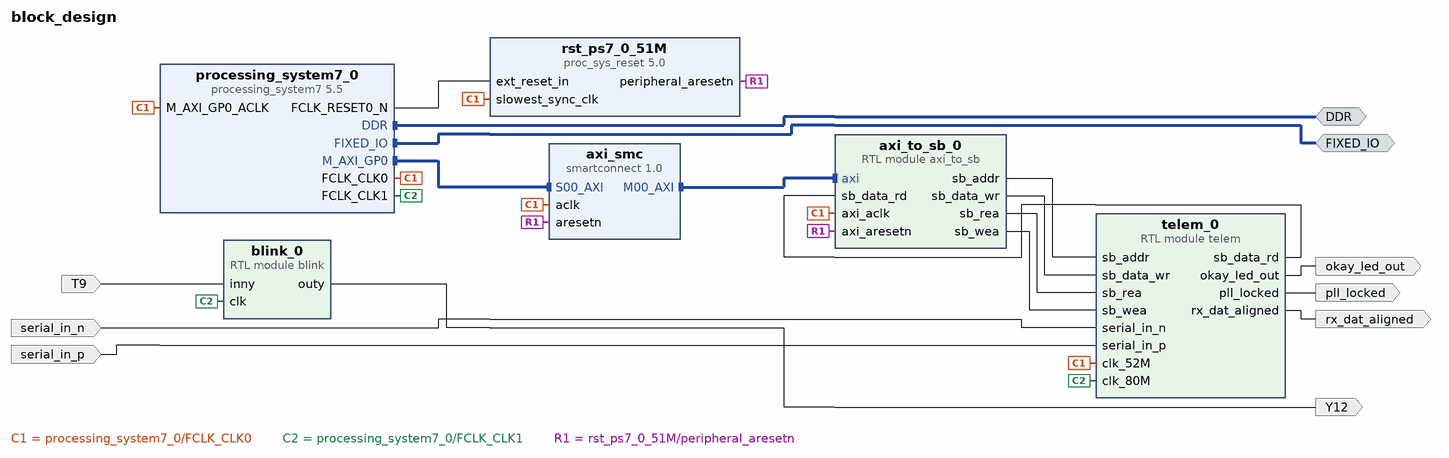
[diagram p0: block diagram of the top level]
# Vivado block design block_design, xc7z020clg400-3, Vivado 2024.2
create_bd_design block_design

create_bd_intf_port -mode Master -vlnv xilinx.com:interface:ddrx_rtl:1.0 DDR
create_bd_intf_port -mode Master -vlnv xilinx.com:display_processing_system7:fixedio_rtl:1.0 FIXED_IO
create_bd_port -dir I T9
create_bd_port -dir O Y12
create_bd_port -dir I serial_in_p
create_bd_port -dir I serial_in_n
create_bd_port -dir O okay_led_out
create_bd_port -dir O pll_locked
create_bd_port -dir O rx_dat_aligned

create_bd_cell -type ip -vlnv xilinx.com:ip:processing_system7:5.5 processing_system7_0
set_property -dict [list \
  CONFIG.PCW_APU_PERIPHERAL_FREQMHZ 867 \
  CONFIG.PCW_CPU_CPU_6X4X_MAX_RANGE 867 \
  CONFIG.PCW_CRYSTAL_PERIPHERAL_FREQMHZ 33.3333 \
  CONFIG.PCW_EN_CLK1_PORT 1 \
  CONFIG.PCW_EN_RST1_PORT 1 \
  CONFIG.PCW_EN_RST2_PORT 1 \
  CONFIG.PCW_EN_RST3_PORT 1 \
  CONFIG.PCW_FPGA0_PERIPHERAL_FREQMHZ 51.2 \
  CONFIG.PCW_FPGA1_PERIPHERAL_FREQMHZ 80 \
  CONFIG.PCW_FPGA2_PERIPHERAL_FREQMHZ 250 \
  CONFIG.PCW_FPGA3_PERIPHERAL_FREQMHZ 200 \
  CONFIG.PCW_FPGA_FCLK1_ENABLE 1 \
  CONFIG.PCW_GPIO_EMIO_GPIO_ENABLE 1 \
  CONFIG.PCW_GPIO_EMIO_GPIO_IO 64 \
  CONFIG.PCW_GPIO_MIO_GPIO_ENABLE 1 \
  CONFIG.PCW_GPIO_MIO_GPIO_IO MIO \
  CONFIG.PCW_GPIO_PERIPHERAL_ENABLE 1 \
  CONFIG.PCW_I2C_RESET_ENABLE 1 \
  CONFIG.PCW_IRQ_F2P_INTR 1 \
  CONFIG.PCW_PRESET_BANK0_VOLTAGE {LVCMOS 1.8V} \
  CONFIG.PCW_PRESET_BANK1_VOLTAGE {LVCMOS 1.8V} \
  CONFIG.PCW_QSPI_GRP_FBCLK_ENABLE 1 \
  CONFIG.PCW_QSPI_GRP_FBCLK_IO {MIO 8} \
  CONFIG.PCW_QSPI_GRP_SINGLE_SS_ENABLE 1 \
  CONFIG.PCW_QSPI_GRP_SINGLE_SS_IO {MIO 1 .. 6} \
  CONFIG.PCW_QSPI_PERIPHERAL_ENABLE 1 \
  CONFIG.PCW_QSPI_QSPI_IO {MIO 1 .. 6} \
  CONFIG.PCW_SD0_GRP_CD_ENABLE 0 \
  CONFIG.PCW_SD0_GRP_WP_ENABLE 0 \
  CONFIG.PCW_SD0_PERIPHERAL_ENABLE 1 \
  CONFIG.PCW_SD0_SD0_IO {MIO 40 .. 45} \
  CONFIG.PCW_SD1_PERIPHERAL_ENABLE 1 \
  CONFIG.PCW_SD1_SD1_IO {MIO 10 .. 15} \
  CONFIG.PCW_SDIO_PERIPHERAL_FREQMHZ 100 \
  CONFIG.PCW_SINGLE_QSPI_DATA_MODE x4 \
  CONFIG.PCW_SPI1_PERIPHERAL_ENABLE 1 \
  CONFIG.PCW_SPI1_SPI1_IO {MIO 46 .. 51} \
  CONFIG.PCW_UART0_PERIPHERAL_ENABLE 1 \
  CONFIG.PCW_UART0_UART0_IO {MIO 50 .. 51} \
  CONFIG.PCW_UART_PERIPHERAL_FREQMHZ 50 \
  CONFIG.PCW_UIPARAM_DDR_FREQ_MHZ 400 \
  CONFIG.PCW_UIPARAM_DDR_MEMORY_TYPE {LPDDR 2} \
  CONFIG.PCW_UIPARAM_DDR_PARTNO Custom \
  CONFIG.PCW_USB_RESET_ENABLE 1 \
  CONFIG.PCW_USE_FABRIC_INTERRUPT 1 \
] [get_bd_cells processing_system7_0]
# 269 more settings of processing_system7_0 are not shown: defaults, MIO pin electricals, DDR timing, and values the tool derives
create_bd_cell -type module -reference blink blink_0
create_bd_cell -type module -reference axi_to_sb axi_to_sb_0
create_bd_cell -type ip -vlnv xilinx.com:ip:proc_sys_reset:5.0 rst_ps7_0_51M
create_bd_cell -type ip -vlnv xilinx.com:ip:smartconnect:1.0 axi_smc
set_property -dict {CONFIG.NUM_MI 1 CONFIG.NUM_SI 1} [get_bd_cells axi_smc]
create_bd_cell -type module -reference telem telem_0

# ---- connections ----

connect_bd_intf_net [get_bd_intf_pins axi_to_sb_0/axi] [get_bd_intf_pins axi_smc/M00_AXI]
connect_bd_intf_net [get_bd_intf_ports DDR] [get_bd_intf_pins processing_system7_0/DDR]
connect_bd_intf_net [get_bd_intf_ports FIXED_IO] [get_bd_intf_pins processing_system7_0/FIXED_IO]
connect_bd_intf_net [get_bd_intf_pins processing_system7_0/M_AXI_GP0] [get_bd_intf_pins axi_smc/S00_AXI]
connect_bd_net [get_bd_pins processing_system7_0/FCLK_CLK0] \
  [get_bd_pins processing_system7_0/M_AXI_GP0_ACLK] [get_bd_pins rst_ps7_0_51M/slowest_sync_clk] [get_bd_pins axi_smc/aclk] \
  [get_bd_pins axi_to_sb_0/axi_aclk] [get_bd_pins telem_0/clk_52M]
connect_bd_net -net T9_1 [get_bd_ports T9] [get_bd_pins blink_0/inny]
connect_bd_net [get_bd_pins axi_to_sb_0/sb_addr] [get_bd_pins telem_0/sb_addr]
connect_bd_net [get_bd_pins axi_to_sb_0/sb_data_wr] [get_bd_pins telem_0/sb_data_wr]
connect_bd_net [get_bd_pins axi_to_sb_0/sb_rea] [get_bd_pins telem_0/sb_rea]
connect_bd_net [get_bd_pins axi_to_sb_0/sb_wea] [get_bd_pins telem_0/sb_wea]
connect_bd_net [get_bd_pins blink_0/outy] [get_bd_ports Y12]
connect_bd_net [get_bd_pins processing_system7_0/FCLK_CLK1] [get_bd_pins telem_0/clk_80M] [get_bd_pins blink_0/clk]
connect_bd_net [get_bd_pins processing_system7_0/FCLK_RESET0_N] [get_bd_pins rst_ps7_0_51M/ext_reset_in]
connect_bd_net [get_bd_pins rst_ps7_0_51M/peripheral_aresetn] [get_bd_pins axi_smc/aresetn] [get_bd_pins axi_to_sb_0/axi_aresetn]
connect_bd_net [get_bd_ports serial_in_n] [get_bd_pins telem_0/serial_in_n]
connect_bd_net [get_bd_ports serial_in_p] [get_bd_pins telem_0/serial_in_p]
connect_bd_net [get_bd_pins telem_0/okay_led_out] [get_bd_ports okay_led_out]
connect_bd_net [get_bd_pins telem_0/pll_locked] [get_bd_ports pll_locked]
connect_bd_net [get_bd_pins telem_0/rx_dat_aligned] [get_bd_ports rx_dat_aligned]
connect_bd_net [get_bd_pins telem_0/sb_data_rd] [get_bd_pins axi_to_sb_0/sb_data_rd]

# ---- address map ----
assign_bd_address -offset 0x40000000 -range 16M -target_address_space [get_bd_addr_spaces processing_system7_0/Data] [get_bd_addr_segs axi_to_sb_0/axi/reg0]

validate_bd_design
save_bd_design
